# EAGLE design ELECTRON- (EAGLE 6.6.0)
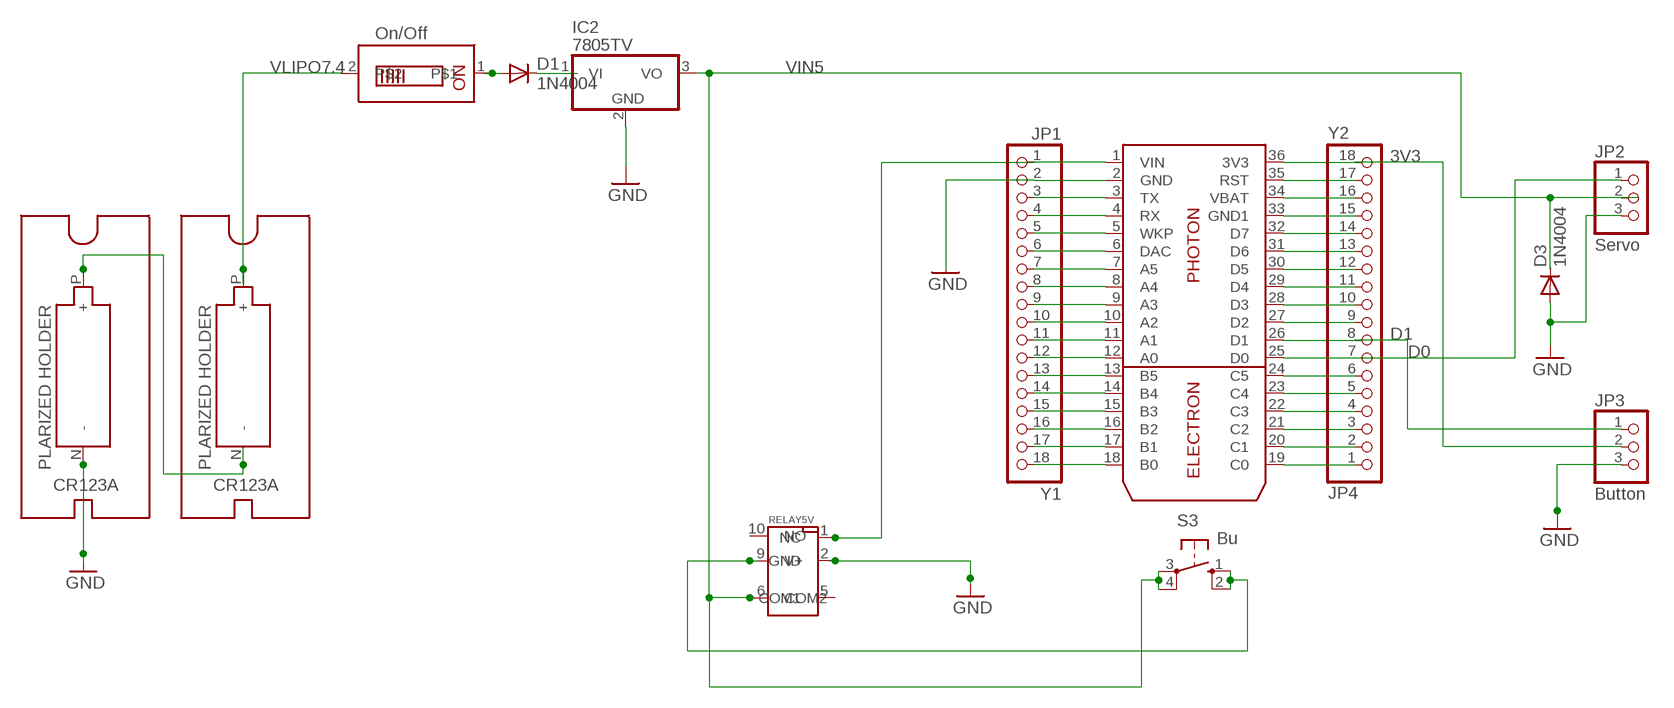
[diagram p0: schematic, sheet 1]

## Parts
D1  1N4004  [DO41-10]
D3  1N4004  [DO41-10]
ELECTRON2  ELECTRON  [ELECTRON-U260]
IC2  7805TV  [TO220V]
JP1  Y1  PINHD-1X18  [1X18]
JP2  Servo  PINHD-1X3/90  [1X03/90]
JP3  Button  PINHD-1X3/90  [1X03/90]
JP4  Y2  PINHD-1X18  [1X18]
S3  Bu  10-XX  [B3F-10XX]
U$1  POLARIZEDHOLDER-CR123A  [CRT123A]
U$2  POLARIZEDHOLDER-CR123A  [CRT123A]
U$3  SWIDGET  [GF-123-0054]
U$4  RELAY5V  [RELAY5V-F]

## Nets
3V3: ELECTRON2.36(3V3) JP3.2 JP4.18
D0: ELECTRON2.25(D0) JP2.1 JP4.7
D1: ELECTRON2.26(D1) JP3.1 JP4.8
GND: D3.A ELECTRON2.2(GND) IC2.2(GND) JP1.2 JP2.3 JP3.3 U$1.N(-) U$4.2(GND)
N$1: S3.1(S) S3.2(S1) U$4.9(V+)
N$3: ELECTRON2.3(TX) JP1.3
N$5: D1.C IC2.1(VI)
N$6: ELECTRON2.4(RX) JP1.4
N$7: ELECTRON2.33(GND1) JP4.15
N$10: ELECTRON2.5(WKP) JP1.5
N$11: U$1.P(+) U$2.N(-)
N$12: ELECTRON2.6(DAC) JP1.6
N$13: ELECTRON2.35(RST) JP4.17
N$14: ELECTRON2.7(A5) JP1.7
N$15: ELECTRON2.34(VBAT) JP4.16
N$16: ELECTRON2.8(A4) JP1.8
N$17: ELECTRON2.9(A3) JP1.9
N$18: ELECTRON2.10(A2) JP1.10
N$19: ELECTRON2.32(D7) JP4.14
N$20: ELECTRON2.11(A1) JP1.11
N$21: ELECTRON2.31(D6) JP4.13
N$22: ELECTRON2.12(A0) JP1.12
N$23: ELECTRON2.13(B5) JP1.13
N$24: ELECTRON2.14(B4) JP1.14
N$25: ELECTRON2.15(B3) JP1.15
N$26: ELECTRON2.16(B2) JP1.16
N$27: ELECTRON2.17(B1) JP1.17
N$28: ELECTRON2.18(B0) JP1.18
N$29: ELECTRON2.30(D5) JP4.12
N$30: ELECTRON2.29(D4) JP4.11
N$31: ELECTRON2.28(D3) JP4.10
N$32: ELECTRON2.27(D2) JP4.9
N$35: ELECTRON2.24(C5) JP4.6
N$36: ELECTRON2.23(C4) JP4.5
N$37: ELECTRON2.22(C3) JP4.4
N$38: ELECTRON2.21(C2) JP4.3
N$39: ELECTRON2.20(C1) JP4.2
N$40: ELECTRON2.19(C0) JP4.1
N$44: D1.A U$3.1
VIN5: D3.C IC2.3(VO) JP2.2 S3.3(P) S3.4(P1) U$4.6(COM2)
VLIPO7.4: U$2.P(+) U$3.2
VO5: ELECTRON2.1(VIN) JP1.1 U$4.1(NC)
Unconnected: U$4.5(COM1) U$4.10(NO)

## Library data of the parts
D1 D3 = diode:1N4004: DIODE general purpose rectifier, 1 A
ELECTRON2 = ELECTRON:ELECTRON: ELECTRON
IC2 = linear:78*: Positive VOLTAGE REGULATOR Source: http://cache.national.com/ds/LM/LM78L05.pdf http://www.fairchildsemi.com/ds/LM/LM7805.pdf
JP1 JP4 = pinhead:PINHD-1X18: PIN HEADER
JP2 JP3 = pinhead:PINHD-1X3: PIN HEADER
S3 = switch-omron:10-XX: OMRON SWITCH; MPN: B3F-1000; OC_FARNELL: 176432; OC_NEWARK: 36M3542
U$1 U$2 = THM POLARIZED HOLDER-CR123A:POLARIZEDHOLDER-CR123A: POLARIZED HOLDER-CR123A
U$3 = SWIDGET:SWIDGET: SWUDGET GF-123-0054
U$4 = RELAY5V:RELAY5V: RELAY5V

## Net classes
0 default: width 0.203 mm

## Board
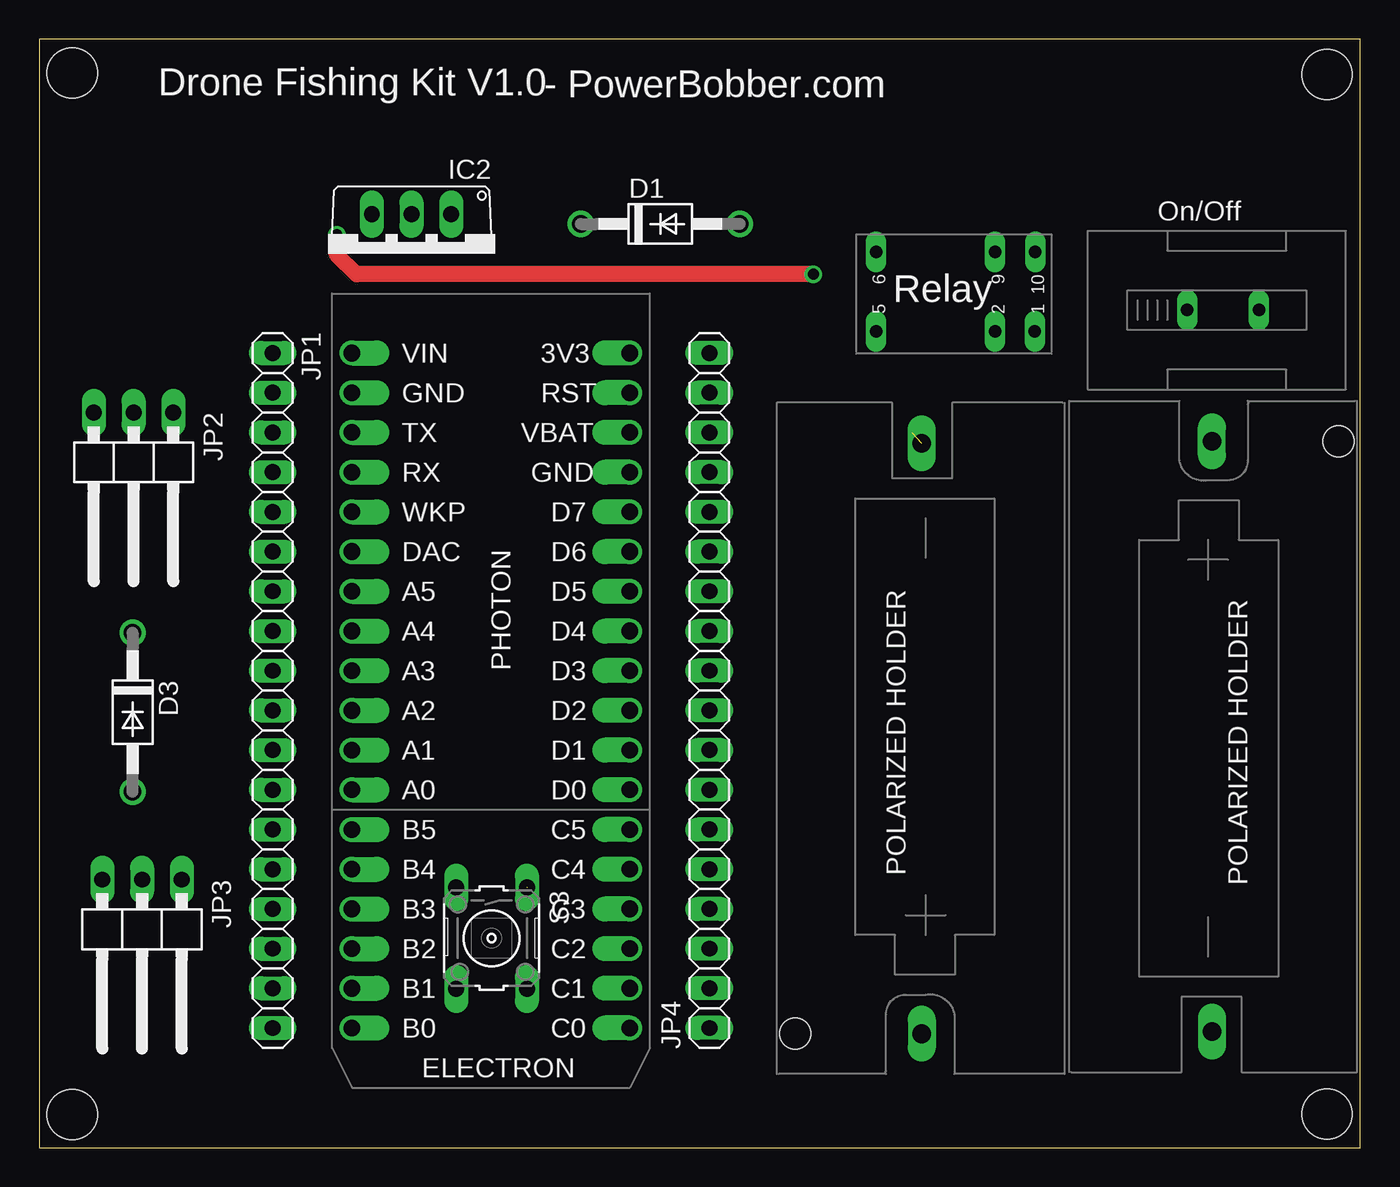
[diagram p1: board, top side]
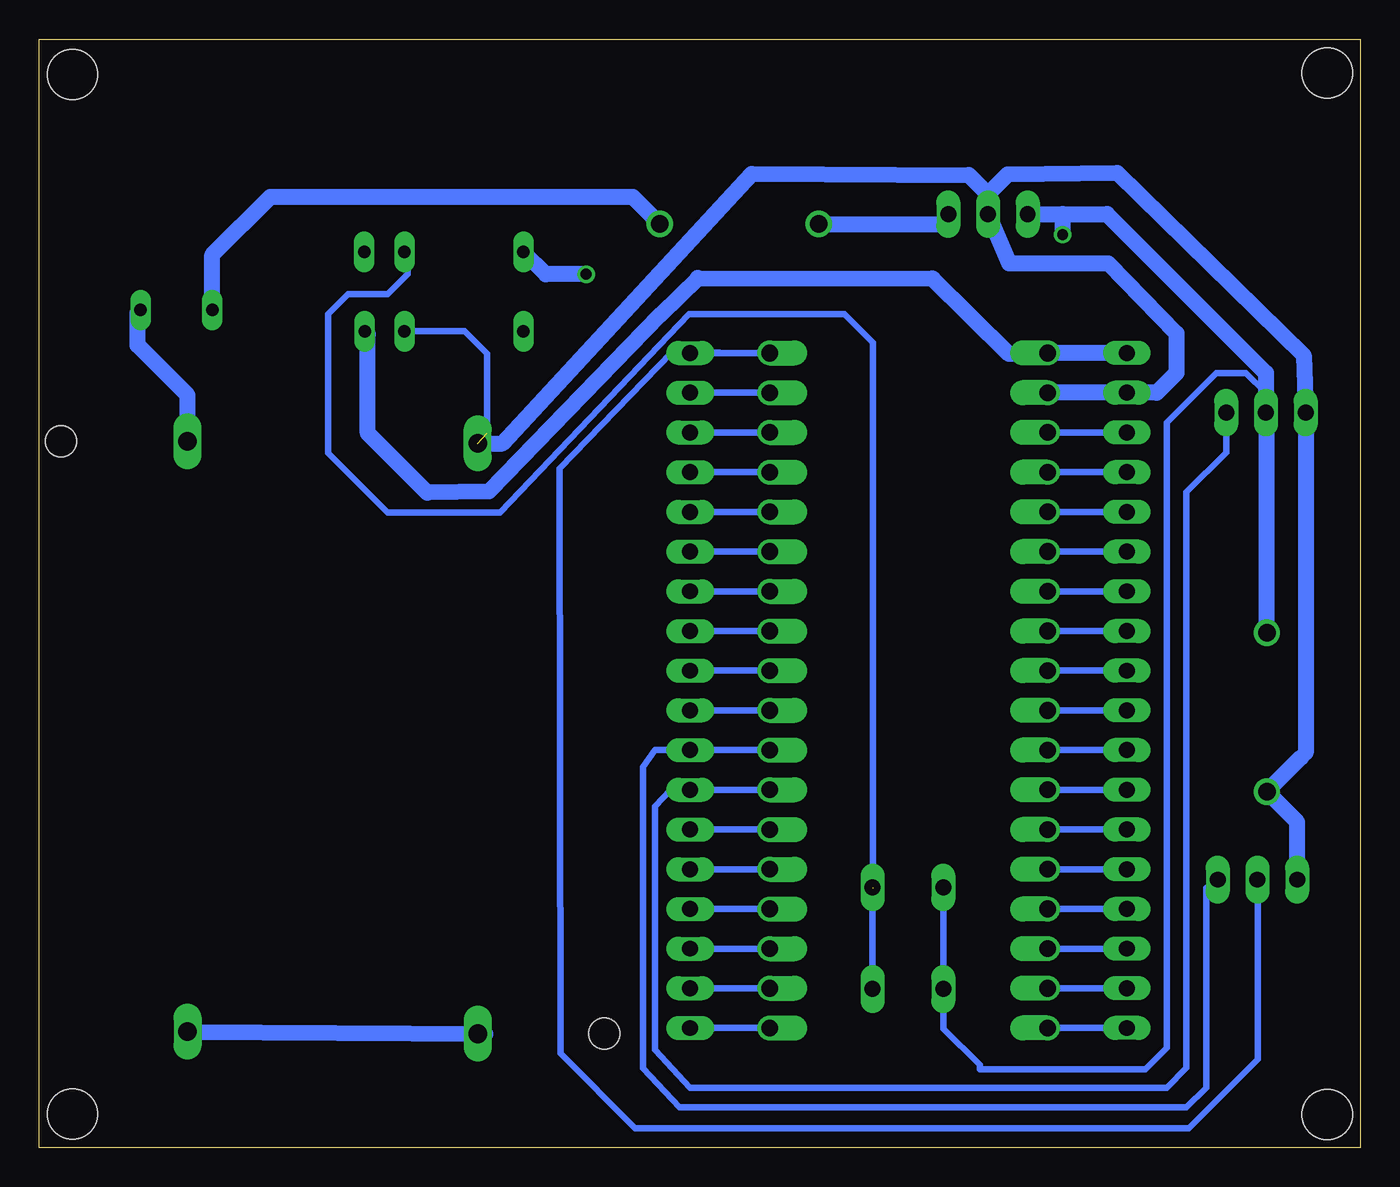
[diagram p2: board, bottom side, seen from below]

Size 84.53 x 70.93 mm. Coordinates in mm from the lower left corner, seen from the top.
Outline: 0,0 84.53,0 84.53,70.93 0,70.92 0,0
Copper layers (1*16): Top 0.035mm / dielectric 1.5mm / Bottom 0.035mm
Design rules "default": minimum track width 10mil, minimum drill 24mil, track to track 8mil, track to pad 8mil, pad to pad 8mil, via to via 8mil, smd to smd 8mil, copper to edge 40mil, drill to drill 8mil, minimum pad ring 10mil, minimum via ring 8mil, stop-mask expansion 4mil, vias tented up to drill 0mil, thermal gap 10mil
Holes 3.2 mm at 2.12,68.77 82.39,68.67 82.4,2.17 2.12,2.12

### Footprints (pad centres in the part's own frame; a part is rotated, then mirrored left to right if it is on the bottom)
DO41-10 = drill 1.118: A 5.08,0; C -5.08,0
ELECTRON-U260 = drill 1.067 pad 1.422 offset: 1 1.27,46.99; 2 1.27,44.45; 3 1.27,41.91; 4 1.27,39.37; 5 1.27,36.83; 6 1.27,34.29; 7 1.27,31.75; 8 1.27,29.21; 9 1.27,26.67; 10 1.27,24.13; 11 1.27,21.59; 12 1.27,19.05; 13 1.27,16.51; 14 1.27,13.97; 15 1.27,11.43; 16 1.27,8.89; 17 1.27,6.35; 18 1.27,3.81; 19 19.05,3.81; 20 19.05,6.35; 21 19.05,8.89; 22 19.05,11.43; 23 19.05,13.97; 24 19.05,16.51; 25 19.05,19.05; 26 19.05,21.59; 27 19.05,24.13; 28 19.05,26.67; 29 19.05,29.21; 30 19.05,31.75; 31 19.05,34.29; 32 19.05,36.83; 33 19.05,39.37; 34 19.05,41.91; 35 19.05,44.45; 36 19.05,46.99
TO220V = drill 1.016 long: 1 -2.54,-2.54; 2 0,-2.54; 3 2.54,-2.54
1X18 = drill 1.016 long: 1 -21.59,0; 2 -19.05,0; 3 -16.51,0; 4 -13.97,0; 5 -11.43,0; 6 -8.89,0; 7 -6.35,0; 8 -3.81,0; 9 -1.27,0; 10 1.27,0; 11 3.81,0; 12 6.35,0; 13 8.89,0; 14 11.43,0; 15 13.97,0; 16 16.51,0; 17 19.05,0; 18 21.59,0
1X03/90 = drill 1.016 long: 1 -2.54,-3.81; 2 0,-3.81; 3 2.54,-3.81
B3F-10XX = drill 1.016 long: 1 -3.251,2.261; 2 3.251,2.261; 3 -3.251,-2.261; 4 3.251,-2.261
CRT123A = drill 1.2 long: N 40.348,9.144; P 2.578,9.144 | hole 1.981: 2.578,17.247
GF-123-0054 = drill 0.8 long: 1 6.35,5.08; 2 10.947,5.08
RELAY5V-F = drill 0.8 long: 1 1.07,6.19; 2 3.61,6.19; 5 11.23,6.19; 6 11.23,1.11; 9 3.61,1.11; 10 1.04,1.11

### Placement (x,y rotation side)
D1  39.74,59.1 0 top
D3  5.98,27.87 270 top
ELECTRON2  18.75,3.85 0 top
IC2  23.83,57.19 180 top
JP1  14.94,29.25 270 top
JP2  6.05,43.22 180 top
JP3  6.58,13.34 180 top
JP4  42.88,29.25 90 top
S3  28.94,13.41 270 top
U$1  65.61,4.72 90 top
U$2  65.89,47.78 270 top
U$3  67.09,48.51 0 top
U$4  64.77,58.42 180 top

### Tracks (layer width: path | path; a pad name or v marks a point on that pad's centre or on a via)
3V3
  Bottom 0.406: JP4.18 ELECTRON2.36 44.03,50.92 51.24,43.45 51.17,6.03 46.39,1.25 10.99,1.25 6.57,5.67 6.57,16.4 6.81,16.64 6.81,16.93 JP3.2 6.45,17.02
D0
  Bottom 0.406: ELECTRON2.25 JP4.7 44.15,22.9 45.14,21.83 45.14,6.26 42.88,3.85 12.4,3.85 11.13,5.12 11.13,41.95 8.59,44.49 JP2.1
D1
  Bottom 0.406: ELECTRON2.26 JP4.8 45.11,25.44 45.9,24.38 45.9,5.1 43.55,2.58 11.13,2.58 9.86,3.85 9.86,16.63 JP3.1
GND  (1 unrouted)
  Bottom 0.406: IC2.2 23.83,61 | 4.04,20.73 4.04,20.85 | 3.51,25.26 3.81,24.96 | 55.88,45.72 55.88,50.8 57.31,52.23 U$4.2
  Bottom 1.016: ELECTRON2.2 JP1.2 13.03,48.3 11.76,49.57 11.76,52.11 16.13,56.58 22.48,56.58 IC2.2 | JP3.3 4.04,20.73 | 4.04,20.85 D3.A 3.81,24.96 | 3.51,25.26 JP2.3 3.63,50.69 15.57,62.37 22.56,62.27 23.83,61 25.05,62.23 38.94,62.31 54.88,45.07 U$1.N
N$1  (1 unrouted)
  Bottom 0.406: 31.19,16.61 31.19,51.51 33.02,53.34 42.95,53.34 55.04,40.64 62.23,40.64 66.04,44.45 66.04,53.34 64.77,54.61 62.23,54.61 60.96,55.88 60.96,57.11 U$4.9 | S3.1 S3.2
N$3
  Bottom 0.406: JP1.3 ELECTRON2.3
N$5
  Bottom 0.406: 26.99,59.1 IC2.1
  Bottom 1.016: D1.C 26.99,59.1
N$6
  Bottom 0.406: JP1.4 ELECTRON2.4
N$7
  Bottom 0.406: JP4.15 ELECTRON2.33
N$10
  Bottom 0.406: JP1.5 ELECTRON2.5
N$11
  Bottom 0.406: 55.97,7.28 U$1.P
  Bottom 1.016: U$2.N 55.97,7.28
N$12
  Bottom 0.406: JP1.6 ELECTRON2.6
N$13
  Bottom 0.406: JP4.17 ELECTRON2.35
N$14
  Bottom 0.406: JP1.7 ELECTRON2.7
N$15
  Bottom 0.406: JP4.16 ELECTRON2.34
N$16
  Bottom 0.406: JP1.8 ELECTRON2.8
N$17
  Bottom 0.406: JP1.9 ELECTRON2.9
N$18
  Bottom 0.406: JP1.10 ELECTRON2.10
N$19
  Bottom 0.406: JP4.14 ELECTRON2.32
N$20
  Bottom 0.406: JP1.11 ELECTRON2.11
N$21
  Bottom 0.406: JP4.13 ELECTRON2.31
N$22
  Bottom 0.406: JP1.12 ELECTRON2.12
N$23
  Bottom 0.406: JP1.13 ELECTRON2.13
N$24
  Bottom 0.406: JP1.14 ELECTRON2.14
N$25
  Bottom 0.406: JP1.15 ELECTRON2.15
N$26
  Bottom 0.406: JP1.16 ELECTRON2.16
N$27
  Bottom 0.406: JP1.17 ELECTRON2.17
N$28
  Bottom 0.406: JP1.18 ELECTRON2.18
N$29
  Bottom 0.406: JP4.12 ELECTRON2.30
N$30
  Bottom 0.406: JP4.11 ELECTRON2.29
N$31
  Bottom 0.406: JP4.10 ELECTRON2.28
N$32
  Bottom 0.406: JP4.9 ELECTRON2.27
N$35
  Bottom 0.406: JP4.6 ELECTRON2.24
N$36
  Bottom 0.406: JP4.5 ELECTRON2.23
N$37
  Bottom 0.406: JP4.4 ELECTRON2.22
N$38
  Bottom 0.406: JP4.3 ELECTRON2.21
N$39
  Bottom 0.406: JP4.2 ELECTRON2.20
N$40
  Bottom 0.406: JP4.1 ELECTRON2.19
N$44
  Bottom 1.016: U$3.1 73.44,57.12 69.72,60.85 46.56,60.85 D1.A
VIN5  (via drill 0.7)
  Top 1.016: v49.53,55.88 20.32,55.88 19.05,57.15 v19.05,58.42
  Bottom 0.406: 12.4,6.39 12.4,46.4 9.22,49.57 7.32,49.57 6.05,48.3 | 5.98,46.97 JP2.2 | 12.4,6.39 | 12.4,6.39 13.77,5.02 24.34,5.02 24.34,5.29 26.67,7.62 26.67,10.15 S3.4 S3.3 | IC2.3 20.36,59.73
  Bottom 1.016: IC2.3 19.05,59.73 | 19.05,59.73 16.21,59.73 6.05,49.57 6.05,48.3 JP2.2 | D3.C 5.98,46.97 | v19.05,58.42 19.05,59.73 | v49.53,55.88 52.11,55.88 U$4.6
VLIPO7.4
  Bottom 0.406: 78.23,53.4 U$3.2
  Bottom 1.016: U$2.P 75.03,48.15 78.23,51.35 78.23,53.4
VO5
  Bottom 0.406: ELECTRON2.1 20.37,50.79 | 27.34,55.6 27.34,55.63 27.41,55.63 | 63.5,52.03 U$4.1
  Bottom 1.016: JP1.1 ELECTRON2.1 | 20.37,50.79 22.47,50.79 27.41,55.63 | 27.34,55.6 42.39,55.65 44.78,53.29 55.75,41.99 59.69,41.91 60.96,43.18 63.5,45.72 63.5,52.03

### Text on the board
tNames: Drone Fishing Kit V1.0 | - PowerBobber.com | Relay